# EAGLE design Adafruit Non-Latching Relay Breakout (EAGLE 9.5.0)
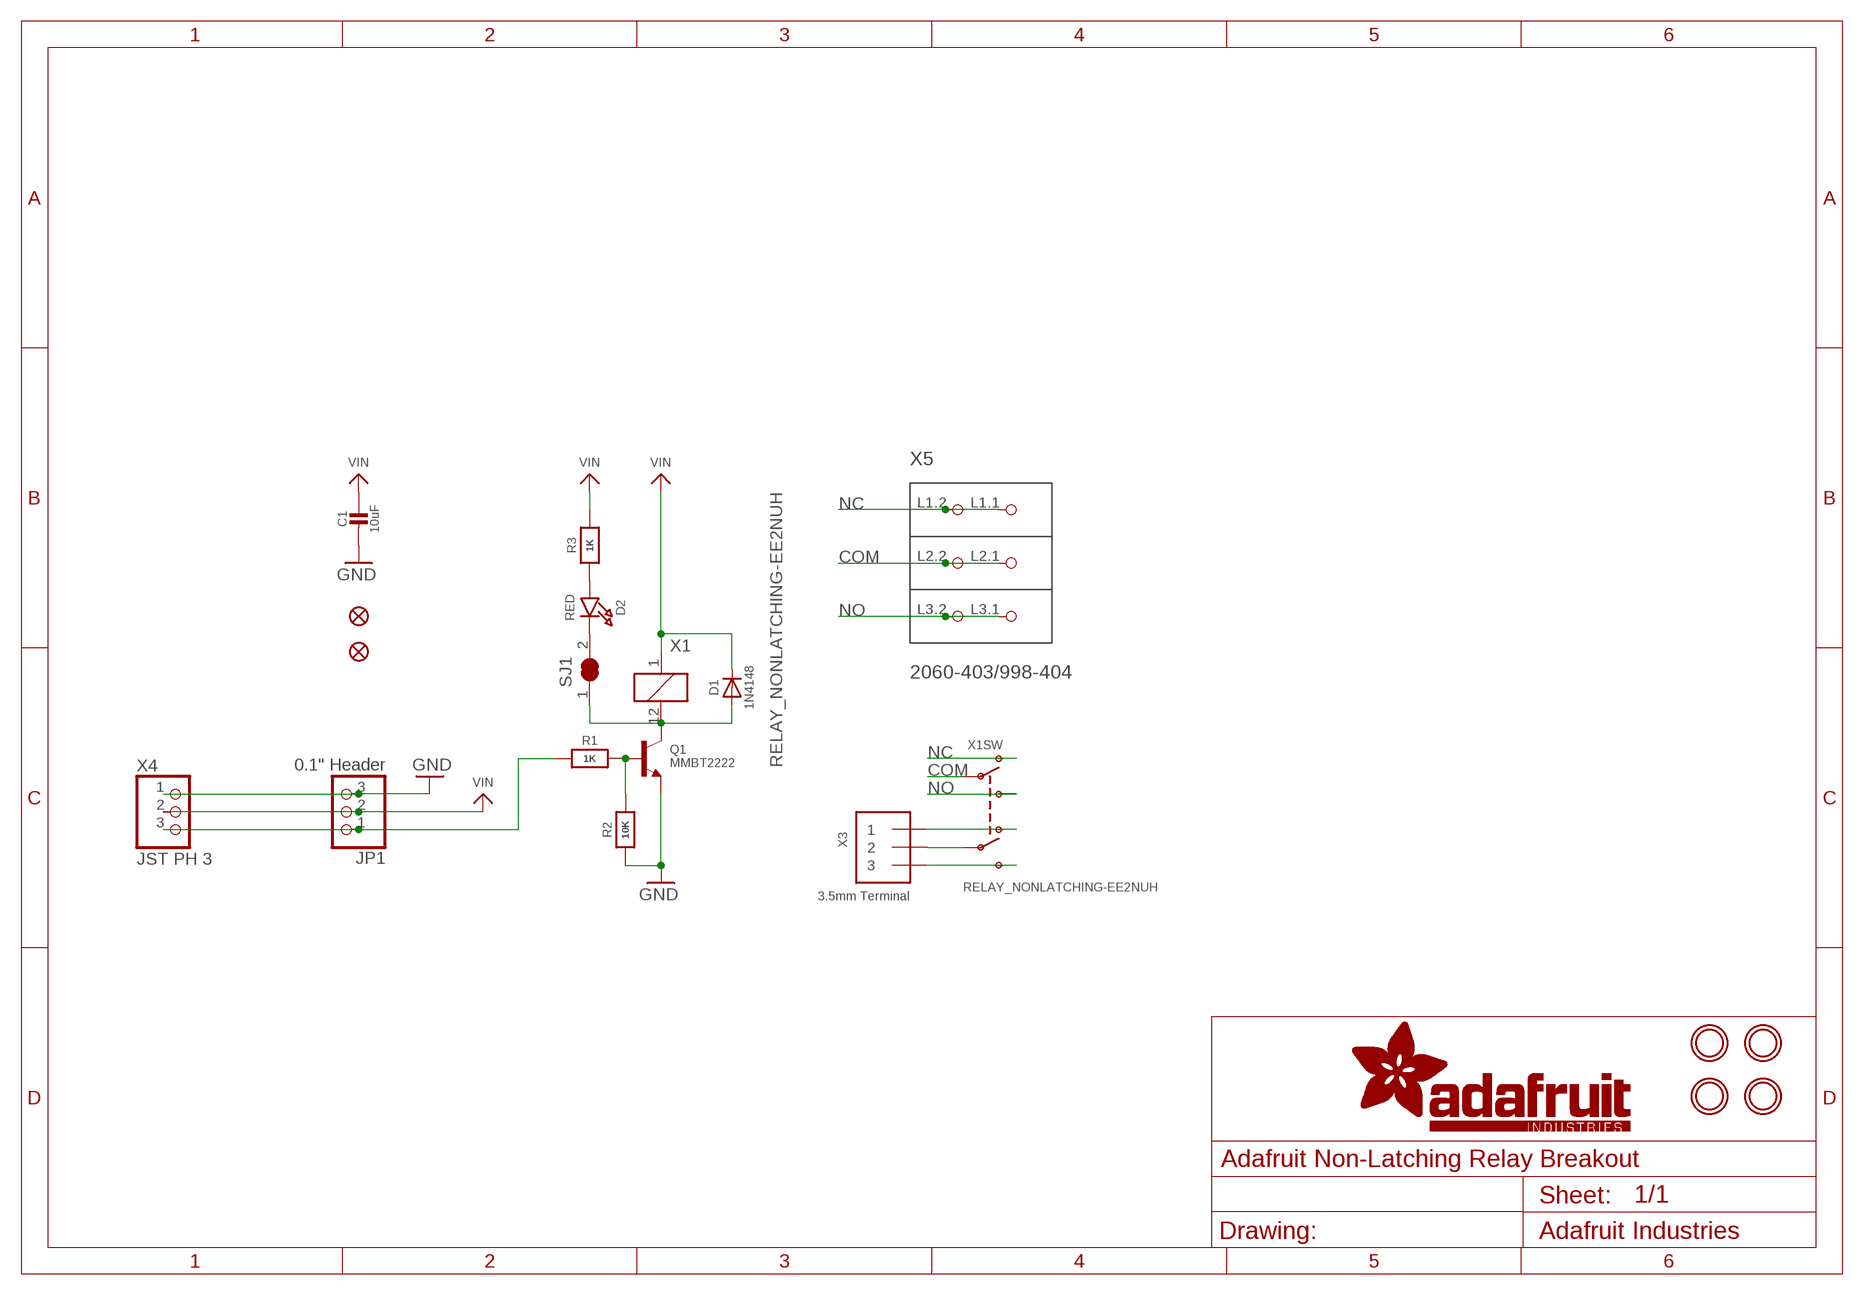
[diagram p0: schematic, sheet 1]

## Parts
C1  10uF  CAP_CERAMIC0805-NOOUTLINE  [0805-NO]
D1  1N4148  DIODESOD-323  [SOD-323]
D2  RED  LED0805_NOOUTLINE  [CHIPLED_0805_NOOUTLINE]
FID2  FIDUCIAL_1MM  [FIDUCIAL_1MM]
FID3  FIDUCIAL_1MM  [FIDUCIAL_1MM]
JP1  0.1" Header  HEADER-1X3  [1X03_OVAL]
Q1  MMBT2222  TRANSISTOR_NPN  [SOT23-R]
R1  1K  RESISTOR_0603_NOOUT  [0603-NO]
R2  10K  RESISTOR_0603_NOOUT  [0603-NO]
R3  1K  RESISTOR_0603_NOOUT  [0603-NO]
SJ1  SOLDERJUMPER_CLOSED  [SOLDERJUMPER_CLOSEDWIRE]
U$1  MOUNTINGHOLE2.5  [MOUNTINGHOLE_2.5_PLATED]
U$8  MOUNTINGHOLE2.5  [MOUNTINGHOLE_2.5_PLATED]
U$9  MOUNTINGHOLE2.5  [MOUNTINGHOLE_2.5_PLATED]
U$10  MOUNTINGHOLE2.5  [MOUNTINGHOLE_2.5_PLATED]
X1  RELAY_NONLATCHING-EE2NUH  [RELAY_EE2_NOLATCH]
X3  3.5mm Terminal  TERMBLOCK_1X3  [TERMBLOCK_1X3-3.5MM]
X4  JST PH 3  CON_JST_PH_3PIN  [JSTPH3]
X5  2060-403/998-404  [P-2060-403/998-404]

## Nets
COM [HV]: X1.9(SW:P1) X5.L2.1(P2.1) X5.L2.2(P2.2)
GND: C1.2 JP1.3 Q1.2(E) R2.1 X4.1
N$1: D1.A Q1.3(C) SJ1.1 X1.12
N$2: X1.3(SW:O2) X3.1
N$3: X1.4(SW:P2) X3.2
N$4: X1.5(SW:S2) X3.3
N$22: Q1.1(B) R1.2 R2.2
N$25: D2.C SJ1.2
N$26: D2.A R3.1
NC [HV]: X1.10(SW:O1) X5.L1.1(P1.1) X5.L1.2(P1.2)
NO [HV]: X1.8(SW:S1) X5.L3.1(P3.1) X5.L3.2(P3.2)
SIGNAL: JP1.1 R1.1 X4.3
VIN: C1.1 D1.C JP1.2 R3.2 X1.1 X4.2

## Library data of the parts
C1 = microbuilder:CAP_CERAMIC: Ceramic Capacitors For new designs, use the packages preceded by an '_' character since they are more reliable: The following footprints should be used on most boards: _0402 - Standard footprint for regular board layouts _0603 - Standard footprint for regular board layouts _0805 - Standard footprint for regular board layouts _1206 - Standard footprint for regular board layouts For extremely tight-pitch boards where space is at a premium, the following 'micro-pitch' footprints can be used (smaller pads, no silkscreen outline, etc.): _0402MP - Micro-pitch footprint for very dense/compact boards _0603MP - Micro-pitch footprint for very dense/compact boards _0805MP - Micro-pitch footprint for very dense/compact boards _1206MP - Micro-pitch footprint for very dense/compact boards
D1 = microbuilder:DIODE: Diode SMA Model Volts Amps Type Vf Ir Digikey # Notes SSA34-E3 40V 3A Schottky 480mV @ 3A 200uA @ 40V SSA34-E3/61TGITR-ND CDBA120-G 20V 1A Schottky 500mV @ 1A 500uA @ 20V 641-1014-6-ND REEL MBRA210 10V 2A Schottky 350mV @ 2A 700uA @ 10V MBRA210LT3 SOD-123 Model Volts Amps Type Vf Ir Order # Notes BAT54T1G 30V 200mA Schottky 800mV @ 200mA 2uA @ 25V BAT54T1GOSTR-ND B0530W 30V 500mA Schottky 430mV @ 500mA 130uA @ 30V B0530W-FDICT-ND REEL MBR120 20V 1A Schottky 340mV @ 1A MBR120VLSFT1GOSCT-ND SOD-323 Model Volts Amps Type Vf Ir Order # Notes PMEG2005EJ 20V 500mA Schottky 355mV @ 500mA 568-4110-1-ND ZLLS410 10V 570mA Schottky 380mV @ 570mA ZLLS410CT-ND 1N4148WS 75V 150mA Silicon/Simple 1V 1N4148WSFSCT-ND REEL SOD-523 Model Volts Amps Type Vf Ir Order # Notes BAT54XV2 30V 200mA Schottky 0.8V @ 100mA BAT54XV2CT-ND TB751S 30V 30mA Schottky RB751S-40TE61CT-ND SOT23-R/W (R = Solder Paste/Reflow Ovens, W = Hand-Soldering) Model Volts Amps Type Vf Ir Order # Notes BAT54FILM 40V 300mA Schottky 497-7162-1-ND POWERDI-5 Model Volts Amps Type Vf Ir Order # Notes PDS560 60V 5A Schottky 670mV @ 5A 150uA @ 60V PDS560DICT-ND
D2 = microbuilder:LED: LED 0603 - 0603 Surface Mount Package 2mA: Green LED - Low Power (3.9mcd, 2ma, 1.7Vf) - Digikey: 475-2709-2-ND Orange LED - Low Power (9.8mcd, 2ma, 1.8Vf) - Digikey: 475-1194-2-ND Red LED - Low Power (5mcd, 2ma, 1.8Vf) - Digikey: 475-1195-2-ND Yellow LED - Low Power (7mcd, 2ma, 1.8Vf) - Digikey: 475-1196-2-ND 5mA: Blue LED - Low Power (17mcd, 5ma, 2.9Vf) - Digikey: LNJ937W8CRACT-ND 0805 - 0805 Surface Mount Package 2mA: Red LED (8.8mcd, 2mA, 1.8Vf, Clear) - Low Power [Digikey: 475-2510-1-ND] Green LED (5mcd, 2mA, 1.8Vf, Clear) - Low Power [Digikey: 475-2730-1-ND] Yellow LED (11.3mcd, 2mA, 1.8Vf, Clear) - Low Power [Digikey: 475-2555-1-ND] 20mA: Red LED (104mcd, 20mA, Diffused) - LS R976 [Digikey: 475-1278-6-ND] Red LED (12mcd, 20mA, 2.0Vf, Clear) - APT2012EC [Digikey: 754-1128-1-ND] Green LED (15mcd, 20mA, 2.2Vf, Clear) - APT2012GC [Digikey: 754-1131-1-ND] Orange LED (160mcd, 20mA, 2.1Vf, Clear) - APT2012SECK [Digikey: 754-1130-1-ND] 1206 - 1206 Surface Mount Package Green LED (26mcd, 20mA, Diffused) - LG N971 [Digikey: 475-1407-6-ND] Red LED (15mcd, 20mA, Diffused) - LH N974 [Digikey: 475-1416-6-ND] Cree - Cree High-Power Surface Mount LEDs XPEBWT-L1-0000-00D50 - White 111lm 350mA 2.9Vf 6200K 110° XTEAWT-00-0000-00000LEE3 - White 114lm 350mA 2.85Vf 5000K 115° Everlight - Everlight 45-21 Series Surface Mount LEDs 45-21/QK2C-B2832AC2CB2/2T - Warm White 2000mcd 20mA 3.25Vf 3050K 120° 45-21/LK2C-B38452C4CB2/2T - Nuetral White 2000mcd 20mA 3.25Vf 4150K 120° 45-21/LK2C-B50634C6CB2/2T - Cold White 2200mcd 20mA 3.25Vf 5650K 120° PLCC2 Reverse Mount LS T77K-J1L2-1-0-2-R18-Z - Red 11.25mcd 2mA 1.8Vf 630nm 120° LO T77K-L1M2-24-Z - Orange 19.6mcd 2mA 1.8Vf 606nm 120° LY T77K-K2M1-26-Z - Yellow 15.7mcd 2mA 1.8Vf 587nm 120°
FID2 FID3 = microbuilder:FIDUCIAL: Fiducial Alignment Points Various fiducial points for machine vision alignment.; BOM: EXCLUDE
JP1 = microbuilder:HEADER-1X3: PIN HEADER
Q1 = microbuilder:TRANSISTOR_NPN: NPN Transistor Transistor (NPN) 500mA 45V - BC817 [Digikey: 568-1631-1-ND] Transistor (NPN) 500mA 45V - BC817,215 [Mouser: 771-BC817-T/R] SOT23-R - SOT23 footprint optimised for use with solder paste and reflow ovens. SOT23-W - SOT23 footprint optimised for hand-soldering (larger pads).
R1-R3 = microbuilder:RESISTOR: Resistors For new designs, use the packages preceded by an '_' character since they are more reliable: The following footprints should be used on most boards: _0402 - Standard footprint for regular board layouts _0603 - Standard footprint for regular board layouts _0805 - Standard footprint for regular board layouts _1206 - Standard footprint for regular board layouts For extremely tight-pitch boards where space is at a premium, the following 'micro-pitch' footprints can be used (smaller pads, no silkscreen outline, etc.): _0402MP - Micro-pitch footprint for very dense/compact boards _0603MP - Micro-pitch footprint for very dense/compact boards _0805MP - Micro-pitch footprint for very dense/compact boards _1206MP - Micro-pitch footprint for very dense/compact boards
SJ1 = microbuilder:SOLDERJUMPER_CLOSED: Solder Jumper - Closed These solder jumpers are closed by default CLOSEDWIRE - 10 mil trace between pads that can be cut and resoldered later CLOSEDPERM - 63 mil trace between pads for a permanent connection (used to 'bridge' two signals, a shameless hack for Eagle). Can double as a test point as well (no cream layer)
U$1 U$8-U$10 = microbuilder:MOUNTINGHOLE: Mounting Hole For #2 screws (0.086"/2.18mm width, 0.094"/2.4mm hole) use 2.5mm; BOM: EXCLUDE
X1 = microbuilder:RELAY_NONLATCHING
X3 = microbuilder:TERMBLOCK_1X3: 3.5mm Terminal block http://www.ladyada.net/library/pcb/eaglelibrary.html
X4 = microbuilder:CON_JST_PH_3PIN
X5 = adafruit_connector:2060-403/998-404: Serie 2060, SMD-Leiterplattenklemme mit Betätigungsdrückern im Gurt 3-polig / Series 2060, SMD terminal block with push-buttons in tape-and-reel packing 3-pole Polzahl / Pole No.: 3 Rastermaß / Pitch: 4 mm Bemessungsspannung / Rated Voltage: 160 V Nennstrom / Nominal Current: 9 A Leiterquerschnitt / Conductor Size: 0.2 - 0.75 mm2 Anschlusstechnik / Connection Technology: CAGE CLAMP® S Leitereinführung (zur Platine) / Conductor entry angle (to PCB): 0 ° Farbe / Color: lichtgrau / light gray Stand: 01.01.2014. Die jeweils aktuellen Daten zu diesem Artikel finden Sie in unserem Produktkatalog, den Sie unter www.wago.com einsehen können. As of: 01/01/2014. Please find the newest data for this article in our product catalogue, which can be viewed under www.wago.com.

## Net classes
1 HV: width 0.406 mm, drill 0.381 mm, clearance 0.762 mm

## Board
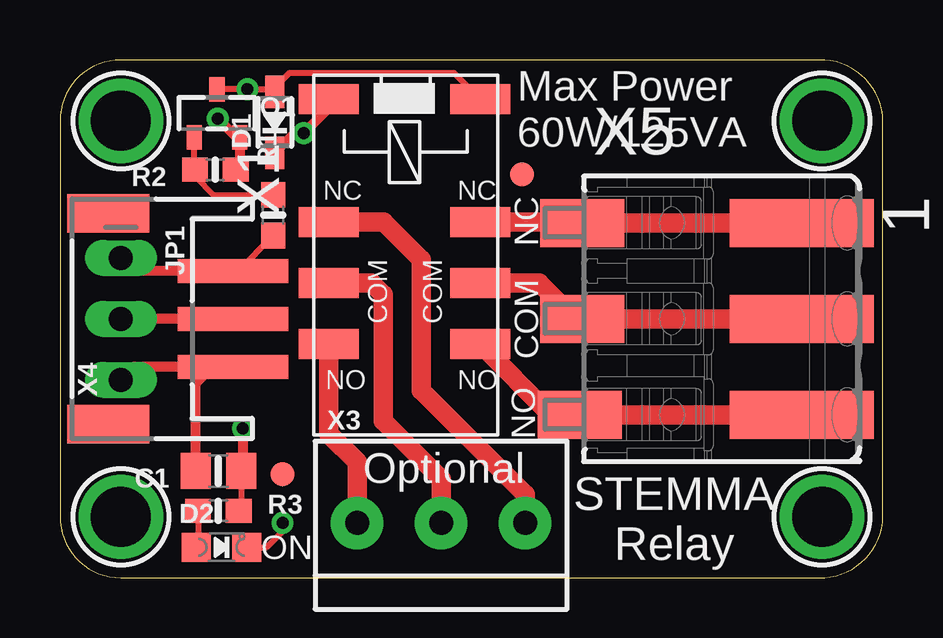
[diagram p1: board, top side]
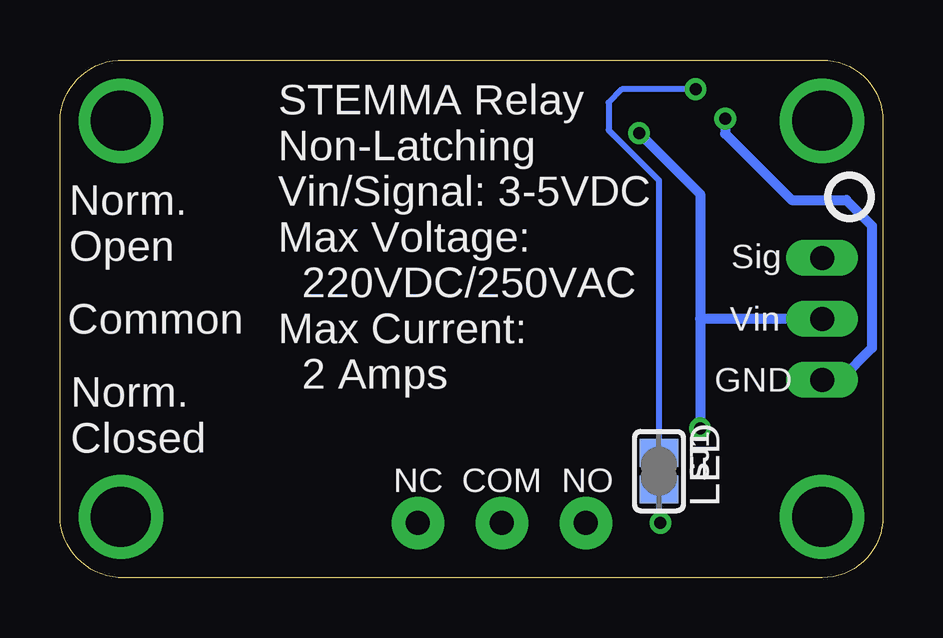
[diagram p2: board, bottom side, seen from below]

Size 34.29 x 21.59 mm. Coordinates in mm from the lower left corner, seen from the top.
Outline: 0,19.05 0,2.54 arc90 2.54,0 31.62,0 arc90 34.29,2.54 34.29,19.05 arc90 31.62,21.59 2.54,21.59 arc90 0,19.05
Copper layers (1*16): Top 0.035mm / dielectric 1.5mm / Bottom 0.035mm
Design rules "adafruit": minimum track width 8mil, minimum drill 15.5mil, track to track 8mil, track to pad 8mil, pad to pad 8mil, via to via 8mil, smd to smd 8mil, copper to edge 10mil, drill to drill 8mil, minimum pad ring 10mil, minimum via ring 8mil, stop-mask expansion 2mil, vias tented up to drill 20mil, thermal gap 10mil

### Footprints (pad centres in the part's own frame; a part is rotated, then mirrored left to right if it is on the bottom)
0805-NO = smd 1.24 x 1.5: 1 -0.95,0; 2 0.95,0
SOD-323 = smd 1.35 x 0.8: A 1.27,0; C -1.27,0
CHIPLED_0805_NOOUTLINE = smd 1.2 x 1.2: A 0,-1.05; C 0,1.05
FIDUCIAL_1MM = smd 1 x 1: 1 0,0
1X03_OVAL = drill 1 long: 1 -2.54,0; 2 0,0; 3 2.54,0
SOT23-R = smd 0.635 x 1.016: 1 -0.95,-1; 2 0.95,-1; 3 0,1
0603-NO = smd 1.075 x 1: 1 -0.85,0; 2 0.85,0
SOLDERJUMPER_CLOSEDWIRE = smd 1.168 x 1.6: 1 -0.762,0; 2 0.762,0 | smd 0.635 x 0.203: WIRE 0,0
MOUNTINGHOLE_2.5_PLATED = drill 2.5 pad 3.2: P$1 0,0
RELAY_EE2_NOLATCH = smd 1.25 x 2.5: 1 -6.5,-3.15; 3 -1.37,-3.15; 4 1.17,-3.15; 5 3.71,-3.15; 8 3.71,3.15; 9 1.17,3.15; 10 -1.37,3.15; 12 -6.5,3.15
TERMBLOCK_1X3-3.5MM = drill 1 pad 2.184: 1 3.5,0; 2 0,0; 3 -3.5,0
JSTPH3 = smd 1 x 4.6: 1 -2,-2.7; 2 0,-2.7; 3 2,-2.7 | smd 1.6 x 3.4: NC1 -4.4,2.5; NC2 4.4,2.5
P-2060-403/998-404 = smd 6 x 2: L1.1 4.625,4; L2.1 4.625,0; L3.1 4.625,-4 | smd 3.5 x 2: L1.2 -4.525,4; L2.2 -4.525,0; L3.2 -4.625,-4

### Placement (x,y rotation side)
C1  6.6,4.45 180 top
D1  8.95,18.99 90 top
D2  6.73,1.27 270 top
FID2  9.27,4.32 0 top
FID3  19.24,16.83 0 top
JP1  2.54,10.79 270 top
Q1  6.54,19.37 0 top
R1  8.89,15.11 90 top
R2  6.48,17.02 180 top
R3  6.6,2.79 0 top
SJ1  9.33,4.45 270 bottom
U$1  31.75,2.54 0 top
U$5  [PCBFEAT-REV-040]  1.4,15.88 0 bottom
U$8  31.75,19.05 0 top
U$9  2.54,19.05 0 top
U$10  2.54,2.54 0 top
X1  14.35,13.46 270 top
X3  15.88,2.29 0 top
X4  4.51,10.79 90 top
X5  26.29,10.79 0 top

### Tracks (layer width: path | path; a pad name or v marks a point on that pad's centre or on a via)
COM
  Top 0.813: X1.9 19.97,12.29 21.46,10.79 X5.L2.2 X5.L2.1
GND  (via drill 0.5)
  Top 0.406: X4.1 6.35,8.79 | 6.35,8.79 3.08,8.79 JP1.3 | C1.2 5.65,8.1 6.35,8.79 | R2.1 7.49,17.18 Q1.2 7.34,18.37 v6.57,19.14
  Bottom 0.406: v6.57,19.14 6.57,18.51 3.81,15.75 1.52,15.75 0.46,14.68 0.46,9.58 1.78,8.26 JP1.3
N$1  (via drill 0.5)
  Top 0.254: 8.84,20.37 v7.81,20.37 Q1.3 | 8.84,20.37 8.88,20.37 9.56,21.04 16.42,21.04 X1.12 | 8.84,20.37 D1.A
  Bottom 0.254: v7.81,20.37 10.87,20.37 11.43,19.81 11.43,18.67 9.34,16.57 SJ1.1
N$2
  Top 0.813: X1.3 13.49,14.83 15.05,13.27 15.05,7.81 19.38,3.48 X3.1
N$3
  Top 0.813: X1.4 12.98,12.29 13.46,11.81 13.46,6.54 15.88,4.13 X3.2
N$4
  Top 0.813: X1.5 11.2,6 12.38,4.83 X3.3
N$22
  Top 0.254: R1.2 8.87,15.94 6.41,15.94 5.63,16.73 R2.2 5.59,17.05 Q1.1
N$25  (via drill 0.5)
  Top 0.254: D2.C 8.61,1.27 9.27,1.94 v9.27,2.29
  Bottom 0.254: SJ1.2 9.34,2.35 v9.27,2.29
N$26
  Top 0.254: R3.1 5.75,1.34 D2.A
NC
  Top 0.813: X1.10 21.73,14.83 X5.L1.2 X5.L1.1
NO
  Top 0.813: X1.8 20.46,6.79 X5.L3.2 X5.L3.1
SIGNAL
  Top 0.254: R1.1 7.42,12.79 X4.3
  Top 0.406: X4.3 3.08,12.79 JP1.1
VIN  (via drill 0.5)
  Top 0.254: C1.1 7.55,4.19 7.55,2.89 R3.2
  Top 0.406: X4.2 JP1.2 | v7.62,6.22 7.62,4.26 7.55,4.19 | X1.1 11.2,19.58 v10.16,18.54 9.78,18.54 D1.C
  Bottom 0.406: v10.16,18.54 7.62,16 7.62,10.79 | 7.62,10.79 v7.62,6.22 | JP1.2 7.62,10.79

### Text on the board
tPlace: Max Power / 60W/125VA | NC | COM | NO | Optional | STEMMA / Relay | ON
bPlace: Norm. / Open | STEMMA Relay / Non-Latching / Vin/Signal: 3-5VDC / Max Voltage: / 220VDC/250VAC / Max Current: / 2 Amps | Sig | Vin | Common | GND | Norm. / Closed | LED | NO | COM | NC